# Altium schematic sheet mainpcb.SchDoc
size A4; SheetNumber: 1; SheetTotal: 1
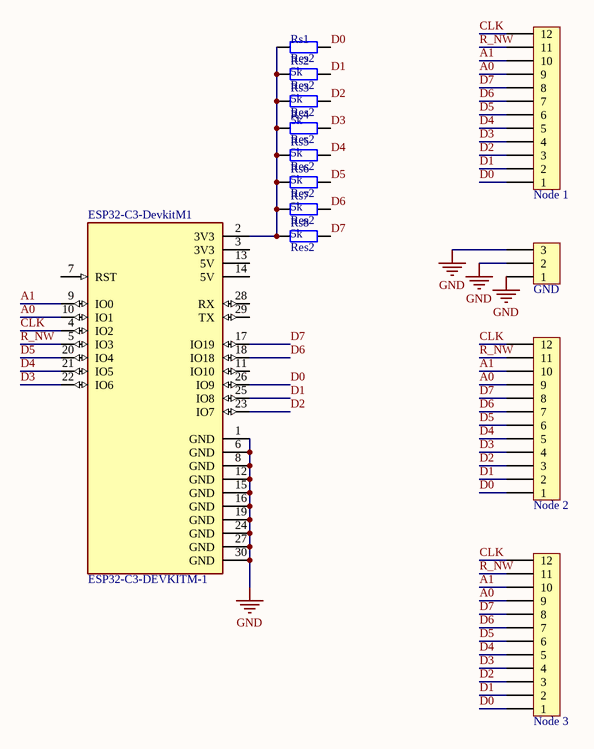
[diagram p0: mainpcb.SchDoc]

## Parts
ESP32-C3-DevkitM1  ESP32-C3-DEVKITM-1  [XCVR_ESP32-C3-DEVKITM-1]
GND  Header 1x3  [Header 1x3]  (value not drawn)
Node_1  Header 1x12  [Header 1x12]  (value not drawn)
Node_2  Header 1x12  [Header 1x12]  (value not drawn)
Node_3  Header 1x12  [Header 1x12]  (value not drawn)
Rs1  Res2  value 5k  [AXIAL-0.4 PCBK]
Rs2  Res2  value 5k  [AXIAL-0.4 PCBK]
Rs3  Res2  value 5k  [AXIAL-0.4 PCBK]
Rs4  Res2  value 5k  [AXIAL-0.4 PCBK]
Rs5  Res2  value 5k  [AXIAL-0.4 PCBK]
Rs6  Res2  value 5k  [AXIAL-0.4 PCBK]
Rs7  Res2  value 5k  [AXIAL-0.4 PCBK]
Rs8  Res2  [AXIAL-0.4 PCBK]

## Nets
GND: ESP32-C3-DevkitM1.1(GND) ESP32-C3-DevkitM1.6(GND) ESP32-C3-DevkitM1.8(GND) ESP32-C3-DevkitM1.12(GND) ESP32-C3-DevkitM1.15(GND) ESP32-C3-DevkitM1.16(GND) ESP32-C3-DevkitM1.19(GND) ESP32-C3-DevkitM1.24(GND) ESP32-C3-DevkitM1.27(GND) ESP32-C3-DevkitM1.30(GND) GND.1 GND.2 GND.3
A0: ESP32-C3-DevkitM1.10(IO1) Node_1.9 Node_2.9 Node_3.9
A1: ESP32-C3-DevkitM1.9(IO0) Node_1.10 Node_2.10 Node_3.10
CLK: ESP32-C3-DevkitM1.4(IO2) Node_1.12 Node_2.12 Node_3.12
D0: ESP32-C3-DevkitM1.26(IO9) Node_1.1 Node_2.1 Node_3.1 Rs1.2
D1: ESP32-C3-DevkitM1.25(IO8) Node_1.2 Node_2.2 Node_3.2 Rs2.2
D2: ESP32-C3-DevkitM1.23(IO7) Node_1.3 Node_2.3 Node_3.3 Rs3.2
D3: ESP32-C3-DevkitM1.22(IO6) Node_1.4 Node_2.4 Node_3.4 Rs4.2
D4: ESP32-C3-DevkitM1.21(IO5) Node_1.5 Node_2.5 Node_3.5 Rs5.2
D5: ESP32-C3-DevkitM1.20(IO4) Node_1.6 Node_2.6 Node_3.6 Rs6.2
D6: ESP32-C3-DevkitM1.18(IO18) Node_1.7 Node_2.7 Node_3.7 Rs7.2
D7: ESP32-C3-DevkitM1.17(IO19) Node_1.8 Node_2.8 Node_3.8 Rs8.2
R_NW: ESP32-C3-DevkitM1.5(IO3) Node_1.11 Node_2.11 Node_3.11
NetESP32-C3-DevkitM1_2: ESP32-C3-DevkitM1.2(3V3) Rs1.1 Rs2.1 Rs3.1 Rs4.1 Rs5.1 Rs6.1 Rs7.1 Rs8.1

Not connected (* = marked no-connect by the designer): ESP32-C3-DevkitM1 3(3V3) 7(RST) 11(IO10) 13(5V) 14(5V) 28(RX) 29(TX)

## Library data of the parts
ESP32-C3-DevkitM1 = ESP32-C3-DEVKITM-1: WiFi Development Tools (802.11) (ENGINEERING SAMPLE ONLY) ESP32-C3 General-Purpose Dev Board, Embeds ESP32-C3-MINI-1, 4 MB Flash, w/ Pin Header; MF: Espressif Systems; Availability: In Stock; Check_prices: https://www.snapeda.com/parts/ESP32-C3-DEVKITM-1/Espressif+Systems/view-part/?ref=eda; SnapEDA_Link: https://www.snapeda.com/parts/ESP32-C3-DEVKITM-1/Espressif+Systems/view-part/?ref=snap; Price: None; MP: ESP32-C3-DEVKITM-1; Value: *; Purchase-URL: https://pricing.snapeda.com/search/part/ESP32-C3-DEVKITM-1/?ref=eda; Package: None
Rs1-Rs8 = Res PCBK: Resistor; Published: 8-Jun-2000; LatestRevisionDate: 17-Jul-2002; LatestRevisionNote: Re-released for DXP Platform.; PackageReference: AXIAL-0.4; Publisher: Altium Limited